# Altium schematic sheet wand_cam.SchDoc: wandcam
size A4 portrait; DrawnBy: Sergei Vlasov; Organization: coreIPM; Address1: L3, 12a Rodborough Rd; Address2: Frenchs Forest; Address3: NSW; Address4: Australia 2086; DocumentNumber: SV270714.01; Revision: 06; SheetNumber: 1; SheetTotal: 1
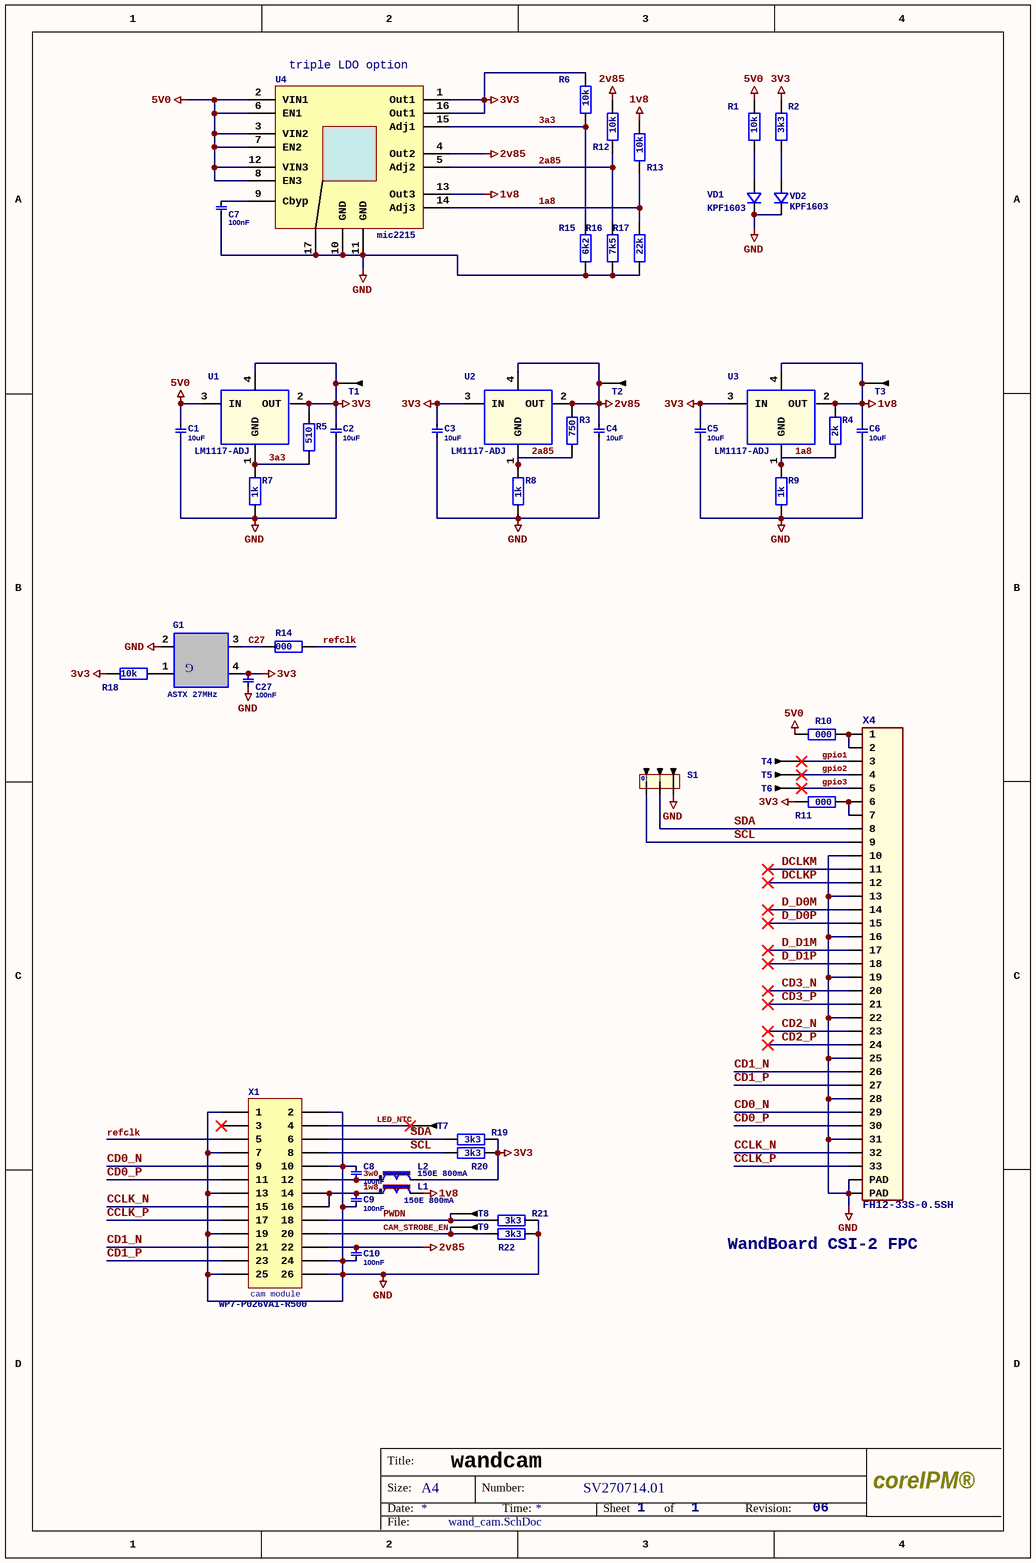
[diagram p0: wand_cam.SchDoc]

## Parts
C1  value 10uF  [Chip1206]  (hidden comment: CerCap)
C2  value 10uF  [Chip1206]  (hidden comment: CerCap)
C3  value 10uF  [Chip1206]  (hidden comment: CerCap)
C4  value 10uF  [Chip1206]  (hidden comment: CerCap)
C5  value 10uF  [Chip1206]  (hidden comment: CerCap)
C6  value 10uF  [Chip1206]  (hidden comment: CerCap)
C7  value 100nF  [Chip0603]  (hidden comment: CerCap)
C8  value 100nF  [Chip0603]  (hidden comment: CerCap)
C9  value 100nF  [Chip0603]  (hidden comment: CerCap)
C10  value 100nF  [Chip0603]  (hidden comment: CerCap)
C27  value 100nF  [Chip0603]  (hidden comment: CerCap)
G1  value ASTX 27MHz  [JO53]  (hidden comment: ASDMB)
L1  value 150E 800mA  [Chip0805]  (hidden comment: Inductor)
L2  value 150E 800mA  [Chip0805]  (hidden comment: Inductor)
R1  value 10k  [Chip0603]  (hidden comment: R_10k)
R2  value 3k3  [Chip0603]  (hidden comment: R_10k)
R3  value 750  [Chip0603]  (hidden comment: R_10k)
R4  value 2k  [Chip0603]  (hidden comment: R_10k)
R5  value 510  [Chip0603]  (hidden comment: R_10k)
R6  value 10k  [Chip0603]  (hidden comment: R_10k)
R7  value 1k  [Chip0603]  (hidden comment: R_10k)
R8  value 1k  [Chip0603]  (hidden comment: R_10k)
R9  value 1k  [Chip0603]  (hidden comment: R_10k)
R10  value 000  [Chip0603]  (hidden comment: R_10k)
R11  value 000  [Chip0603]  (hidden comment: R_10k)
R12  value 10k  [Chip0603]  (hidden comment: R_10k)
R13  value 10k  [Chip0603]  (hidden comment: R_10k)
R14  value 000  [Chip0603]  (hidden comment: R_3k3)
R15  value 6k2  [Chip0603]  (hidden comment: R_10k)
R16  value 7k5  [Chip0603]  (hidden comment: R_10k)
R17  value 22k  [Chip0603]  (hidden comment: R_10k)
R18  value 10k  [Chip0603]  (hidden comment: R_3k3)
R19  value 3k3  [Chip0603]  (hidden comment: R_10k)
R20  value 3k3  [Chip0603]  (hidden comment: R_10k)
R21  value 3k3  [Chip0603]  (hidden comment: R_10k)
R22  value 3k3  [Chip0603]  (hidden comment: R_10k)
S1  edid  [HDR1X3]  (value not drawn)
T1  Test Point  [Testpoint]  (value not drawn)
T2  Test Point  [Testpoint]  (value not drawn)
T3  Test Point  [Testpoint]  (value not drawn)
T4  Test Point  [Testpoint]  (value not drawn)
T5  Test Point  [Testpoint]  (value not drawn)
T6  Test Point  [Testpoint]  (value not drawn)
T7  Test Point  [Testpoint]  (value not drawn)
T8  Test Point  [Testpoint]  (value not drawn)
T9  Test Point  [Testpoint]  (value not drawn)
U1  value LM1117-ADJ  [SOT223]  (hidden comment: LM117)
U2  value LM1117-ADJ  [SOT223]  (hidden comment: LM117)
U3  value LM1117-ADJ  [SOT223]  (hidden comment: LM117)
U4  mic2215  [MLF16-0.65]
VD1  value KPF1603  [KPF1608]  (hidden comment: LED)
VD2  value KPF1603  [KPF1608]  (hidden comment: LED)
X1  cam module  value WP7-P026VA1-R500  [WP7_26]
X4  value FH12-33S-0.5SH  [FH12-33]  (hidden comment: FPC connector)

## Nets
1v8: C6.1 L1.2 R4.2 R13.2 T3.1 U3.2(OUT) U3.4(VOUT) U4.13(Out3)
2v85: C4.1 C10.2 R3.2 R12.2 T2.1 U2.2(OUT) U2.4(VOUT) U4.4(Out2) X1.22
3v3: C2.1 C3.1 C5.1 C27.2 G1.4 L2.2 R2.2 R5.2 R6.2 R11.1 R18.2 R19.1 R20.1 T1.1 U1.2(OUT) U1.4(VOUT) U2.3(IN) U3.3(IN) U4.1(Out1) U4.16(Out1)
5V0: C1.1 R1.2 R10.1 U1.3(IN) U4.2(VIN1) U4.3(VIN2) U4.6(EN1) U4.7(EN2) U4.8(EN3) U4.12(VIN3)
GND: C1.2 C2.2 C3.2 C4.2 C5.2 C6.2 C7.1 C8.2 C9.1 C10.1 C27.1 G1.2 R7.1 R8.1 R9.1 R15.1 R16.1 R17.1 R21.1 R22.1 S1.3 U4.10(GND) U4.11(GND) U4.17(GND) VD1.K VD2.K X1.1 X1.2 X1.7 X1.10 X1.13 X1.19 X1.24 X1.25 X1.26 X4.10 X4.13 X4.16 X4.19 X4.22 X4.25 X4.28 X4.31 X4.P1(PAD) X4.P2(PAD)
1a8: R4.1 R9.2 R13.1 R17.2 U3.1(GND) U4.14(Adj3)
1w8: C9.2 L1.1 X1.14 X1.16
2a85: R3.1 R8.2 R12.1 R16.2 U2.1(GND) U4.5(Adj2)
3a3: R5.1 R6.1 R7.2 R15.2 U1.1(GND) U4.15(Adj1)
3w0: C8.1 L2.1 X1.12
C27: G1.3 R14.2
CAM_STROBE_EN: R22.2 T9.1 X1.20
CCLK_N: X1.15 X4.32
CCLK_P: X1.17 X4.33
CD0_N: X1.9 X4.29
CD0_P: X1.11 X4.30
CD1_N: X1.21 X4.26
CD1_P: X1.23 X4.27
CD2_N: X4.23
CD2_P: X4.24
CD3_N: X4.20
CD3_P: X4.21
D_D0M: X4.14
D_D0P: X4.15
D_D1M: X4.17
D_D1P: X4.18
DCLKM: X4.11
DCLKP: X4.12
gpio1: T4.1 X4.3
gpio2: T5.1 X4.4
gpio3: T6.1 X4.5
LED_NTC: T7.1 X1.4
PWDN: R21.2 T8.1 X1.18
refclk: R14.1 X1.5
SCL: R20.2 S1.1 X1.8 X4.9
SDA: R19.2 S1.2 X1.6 X4.8
NetC7_2: C7.2 U4.9(Cbyp)
NetG1_1: G1.1 R18.1
NetR1_1: R1.1 VD1.A
NetR2_1: R2.1 VD2.A
NetR10_2: R10.2 X4.1 X4.2
NetR11_2: R11.2 X4.6 X4.7

Not connected (* = marked no-connect by the designer): X1 3*

## Notes on the sheet
- (near U4) triple LDO option
- (near X4) WandBoard CSI-2 FPC
- Title:
- Size:
- Date:
- A4
- Number:
- Time:
- Sheet
- of
- Revision:
- coreIPM®
- File:
- (in symbol JO53) G

## Library data of the parts
C1-C6 = c10u: Manufacturer: Bourns, Kemet; Class: Capacitors; Author: S.Vlasov; Name: CerCap
C7-C10 C27 = c100n: Manufacturer: Bourns, Kemet; Class: Capacitors; Author: S.Vlasov; Name: CerCap
G1 = JO53: Generator; Manufacturer: Abracon; Name: ASTX-H11; Author: S.Vlasov
L1 L2 = L_150E: Name: CV201210-R27; Datasheet: CV201210.pdf
R1-R13 R15-R17 R19-R22 = R_10k: Resistor 0402; Name: Resistor 0402 5%; Class: Resistors; Author: S.Vlasov
R14 R18 = R_3k3: Resistor 0402; Name: Resistor 0402 5%; Class: Resistors; Author: S.Vlasov
S1 = PLS-3: PLS2 3pin male; Value: PLS-3; Name: PLS-3
T1-T9 = tp: Single pin PLS2; Name: PLS2-1; Value: PLS2-1
U1-U3 = LM1117: Dropout linear Regulator; Manufacturer: Na Semiconductor; Name: LM1117; Package: SOT223
U4 = mic2215: Triple LDO Adjustable; Manufacturer: Micrel; Name: mic2215; Value: mic2215; Package: QFN16; Notes: LDO
VD1 VD2 = LED: Typical RED, GREEN, YELLOW, AMBER GaAs LED; Manufacturer: KingBrignt; Name: LED; Package: Chip0603
X1 = MHDR2X13: iphone4 camera module connector 26 pins; Manufacturer: JAE; Name: WP1_26; LatestRevisionDate: 17-Jul-2002; LatestRevisionNote: Re-released for DXP Platform.; Publisher: Altium Limited; URL: http://www.digikey.com/product-detail/en/WP7-P026VA1-R500/670-2587-6-ND/3694499?WT.z_cid=ref_octopart_dkc_buynow&site=us
X4 = FP124-334M4: Manufacturer: I-PEX; Name: FP124-334M4